# Altium schematic sheet POWER.SchDoc
size A; SheetNumber: 2; SheetTotal: 2
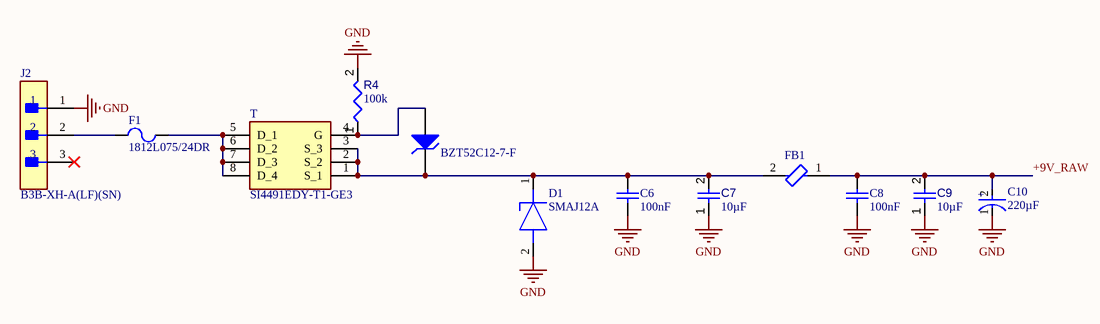
[diagram p0: POWER.SchDoc]

## Parts
?  BZT52C12-7-F  [DIOD-SOD123-2_V]
C6  value 100nF  [KEMT-1206-2_N]  (hidden comment: C1206C104K5RACTU)
C7  value 10µF  [CAPC3216X180X50NL20T25]  (hidden comment: Capacitor 10 uF +/- 10% 16 V 1206)
C8  value 100nF  [KEMT-1206-2_N]  (hidden comment: C1206C104K5RACTU)
C9  value 10µF  [CAPC3216X180X50NL20T25]  (hidden comment: Capacitor 10 uF +/- 10% 16 V 1206)
C10  value 220µF  [FP-RAD-TH-D_8_0_5-L_11_5-MFG]  (hidden comment: EEUFR1E221)
D1  SMAJ12A  [SMAJ12A-Footprint-1]
F1  1812L075/24DR  [LFUS-1812L07524DR_V]
FB1  BLM31PG121SN1L  [FP-BLM31-0_2-t1_1-MFG]  (value not drawn)
J2  B3B-XH-A(LF)(SN)  [FP-B3B-XH-A_LF_SN-MFG]
R4  value 100k  [RESC3216X60X45ML15T20]  (hidden comment: Resistor 100k +/-1% 1206 250 mW)
T  SI4491EDY-T1-GE3  [SI4491EDY-T1-GE3-Footprint-1]

## Nets
GND: C6.1 C7.1 C8.1 C9.1 C10.1(C) D1.2(A) J2.1 R4.2
+9V_RAW: C8.2 C9.2 C10.2(A) FB1.1
Net?_1: ?.1(A) R4.1 T.4(G)
Net?_2: ?.2(K) C6.2 C7.2 D1.1(K) FB1.2 T.1(S_1) T.2(S_2) T.3(S_3)
NetF1_1: F1.1 J2.2
NetF1_2: F1.2 T.5(D_1) T.6(D_2) T.7(D_3) T.8(D_4)

Not connected (* = marked no-connect by the designer): J2 3*

## Notes on the sheet
- (in symbol CMP-001-00105-1) +

## Library data of the parts
? = CMP-004-00040-1: BZT52C12 Series 500 mW 12 V 10 mA Surface Mount Zener Diode - SOD-123; Forward Voltage: 900mV; Mounting Technology: Surface Mount; Pins: 2; Max Operating Temperature: 150°C; Min Operating Temperature: -65°C
C6 C8 = CMP-001-00104-1: Multilayer Ceramic Capacitors MLCC - SMD/SMT 50V 0.1uF X7R 1206 10%; Case/Package: 1206; Max Operating Temperature: 125°C; Pins: 2; Min Operating Temperature: -55°C; Mounting Technology: Surface Mount; Voltage Rating: 50V; Tolerance: 10%
C7 C9 = CMP-001-00016-6: Chip Capacitor, 10 uF, +/- 10%, 16 V, 1206 (3216 Metric); Capacitor Type: Ceramic; Voltage Rating: 16V; Tolerance: 10%; Min Operating Temperature: -55°C; Pins: 2; Mounting Technology: SM; Case/Package: 1206; Max Operating Temperature: 125°C; RoHS Compliant: True
C10 = CMP-001-00105-1: Radial Can ALUMINUM ELECTROLYTIC CAPACITOR FR 25V 220muF ±20% 0.315Dia 8.00mm; Ripple Current: 950mA; Min Operating Temperature: -40°C; Voltage Rating: 25V; Tolerance: 20%; Case/Package: Radial; Ripple Current (AC): 950mA; Max Operating Temperature: 105°C; Mounting Technology: Through Hole
D1 = CMP-004-00041-1: SMAJ Series 19.9 V 0.4 kW Surface Mount Uni-Directional TVS Diode - DO-214AC; Forward Voltage: 3.5V; Max Surge Current: 20.1A; Min Operating Temperature: -65°C; Max Operating Temperature: 150°C; Mounting Technology: Surface Mount; Pins: 2
F1 = CMP-005-00016-1: PTC Resettable Fuse 0.75A(hold) 1.5A(trip) 24VDC 100A 0.8W 0.2s 0.11Ohm SMD Solder Pad 1812 T/R; Case/Package: 1812; Min Operating Temperature: -40°C; Max Operating Temperature: 85°C; Current Rating: 100A; Mounting Technology: Surface Mount
FB1 = CMP-009-00180-1: Ferrite Beads Multi-Layer 120Ohm 25% 100MHz 3.5A 0.02Ohm DCR 1206 T/R; Case/Package: 1206; Min Operating Temperature: -55°C; Tolerance: 25%; Mounting Technology: Surface Mount; Max Operating Temperature: 125°C
J2 = CMP-002-00074-1: Connector Header, XH Series, 3 Position, 2.50mm, Through Hole, Press-Fit, Solder, Natural; Voltage Rating: 250V; Gender: Male; Connector Type: Male Pin; Max Current Rating: 3A; Pins: 3; Min Operating Temperature: -25°C; Mounting Technology: Through Hole; Max Operating Temperature: 85°C
R4 = CMP-009-00025-5: Chip Resistor, 100 KOhm, +/- 1%, 0.25 W, -55 to 155 degC, 1206 (3216 Metric); Voltage Rating: 200V; Power: 250mW; RoHS Compliant: True; Max Operating Temperature: 155°C; Pins: 2; Tolerance: 1%; Mounting Technology: SM; Case/Package: 1206; Min Operating Temperature: -55°C
T = CMP-013-00037-1: Mosfet P-ch 30V 17.3A 8-SO / Trans Mosfet P-ch 30V 17.3A 8-PIN So T/r; Pins: 8; Case/Package: SOIC; Min Operating Temperature: -55°C; Max Operating Temperature: 150°C; Mounting Technology: Surface Mount